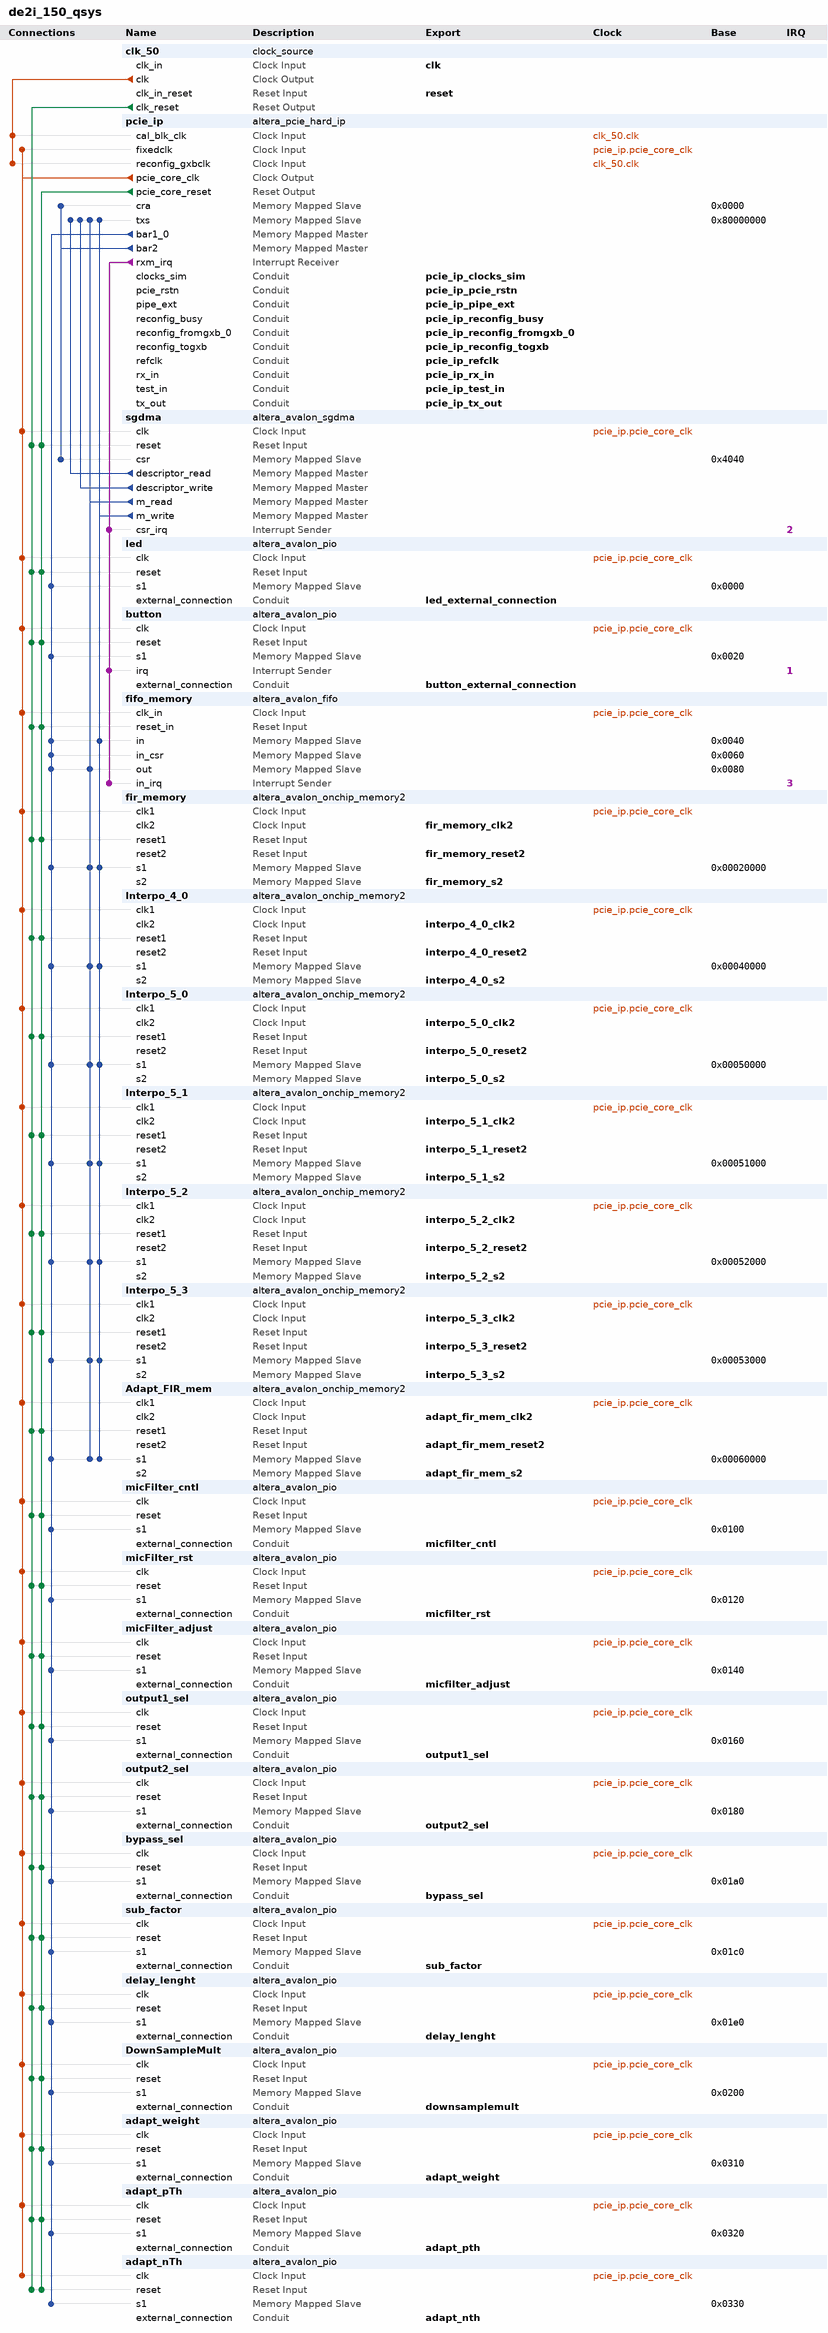
[diagram p0: system contents]
# Platform Designer (Qsys) system de2i_150_qsys, Cyclone IV GX EP4CGX150DF31C7
# Parameters at their usual value, and those the tool derives, are not listed.
package require -exact qsys 14.0
create_system de2i_150_qsys
set_project_property DEVICE_FAMILY {Cyclone IV GX}
set_project_property DEVICE EP4CGX150DF31C7

add_instance clk_50 clock_source 14.0
set_instance_parameter_value clk_50 clockFrequency 50000000

add_instance pcie_ip altera_pcie_hard_ip 14.0
set_instance_parameter_value pcie_ip p_pcie_test_out_width None
set_instance_parameter_value pcie_ip {BAR Type} {64 bit Prefetchable,Not used,32 bit Non-Prefetchable,Not used,Not used,Not used}
set_instance_parameter_value pcie_ip vendor_id 4466
set_instance_parameter_value pcie_ip device_id 57345
set_instance_parameter_value pcie_ip class_code 0
set_instance_parameter_value pcie_ip subsystem_vendor_id 4466
set_instance_parameter_value pcie_ip subsystem_device_id 4
set_instance_parameter_value pcie_ip my_advanced_errors false
set_instance_parameter_value pcie_ip my_enable_ecrc_check false
set_instance_parameter_value pcie_ip my_enable_ecrc_gen false
set_instance_parameter_value pcie_ip CG_NO_CPL_REORDERING 0
set_instance_parameter_value pcie_ip CG_ENABLE_A2P_INTERRUPT 0
set_instance_parameter_value pcie_ip p_user_msi_enable 0
set_instance_parameter_value pcie_ip CB_A2P_ADDR_MAP_PASS_THRU_BITS 31
set_instance_parameter_value pcie_ip {PCIe Address 63:32} 0x00000000,0x00000000,0x00000000,0x00000000,0x00000000,0x00000000,0x00000000,0x00000000,0x00000000,0x00000000,0x00000000,0x00000000,0x00000000,0x00000000,0x00000000,0x00000000
set_instance_parameter_value pcie_ip {PCIe Address 31:0} 0x00000000,0x00000000,0x00000000,0x00000000,0x00000000,0x00000000,0x00000000,0x00000000,0x00000000,0x00000000,0x00000000,0x00000000,0x00000000,0x00000000,0x00000000,0x00000000

add_instance sgdma altera_avalon_sgdma 14.0
set_instance_parameter_value sgdma enableBurstTransfers false
set_instance_parameter_value sgdma enableUnalignedTransfers false
set_instance_parameter_value sgdma readBlockDataWidth 64
set_instance_parameter_value sgdma sinkErrorWidth 0
set_instance_parameter_value sgdma sourceErrorWidth 0
set_instance_parameter_value sgdma transferMode MEMORY_TO_MEMORY
set_instance_parameter_value sgdma writeBurstcountWidth 4

add_instance led altera_avalon_pio 14.0
set_instance_parameter_value led direction Output
set_instance_parameter_value led width 4

add_instance button altera_avalon_pio 14.0
set_instance_parameter_value button captureEdge true
set_instance_parameter_value button direction Input
set_instance_parameter_value button edgeType FALLING
set_instance_parameter_value button generateIRQ true
set_instance_parameter_value button irqType EDGE
set_instance_parameter_value button width 4

add_instance fifo_memory altera_avalon_fifo 14.0
set_instance_parameter_value fifo_memory avalonMMAvalonMMDataWidth 64
set_instance_parameter_value fifo_memory bitsPerSymbol 16
set_instance_parameter_value fifo_memory channelWidth 8
set_instance_parameter_value fifo_memory errorWidth 8
set_instance_parameter_value fifo_memory fifoDepth 2048
set_instance_parameter_value fifo_memory fifoInputInterfaceOptions AVALONMM_WRITE
set_instance_parameter_value fifo_memory fifoOutputInterfaceOptions AVALONMM_READ
set_instance_parameter_value fifo_memory singleClockMode true
set_instance_parameter_value fifo_memory symbolsPerBeat 2
set_instance_parameter_value fifo_memory useIRQ true
set_instance_parameter_value fifo_memory usePacket true
set_instance_parameter_value fifo_memory useReadControl false

add_instance fir_memory altera_avalon_onchip_memory2 14.0
set_instance_parameter_value fir_memory dataWidth 32
set_instance_parameter_value fir_memory dualPort true
set_instance_parameter_value fir_memory initMemContent true
set_instance_parameter_value fir_memory initializationFileName onchip_memory
set_instance_parameter_value fir_memory memorySize 4096

add_instance Interpo_4_0 altera_avalon_onchip_memory2 14.0
set_instance_parameter_value Interpo_4_0 dataWidth 32
set_instance_parameter_value Interpo_4_0 dualPort true
set_instance_parameter_value Interpo_4_0 initMemContent true
set_instance_parameter_value Interpo_4_0 initializationFileName onchip_memory
set_instance_parameter_value Interpo_4_0 memorySize 128

add_instance Interpo_5_0 altera_avalon_onchip_memory2 14.0
set_instance_parameter_value Interpo_5_0 dataWidth 32
set_instance_parameter_value Interpo_5_0 dualPort true
set_instance_parameter_value Interpo_5_0 initMemContent true
set_instance_parameter_value Interpo_5_0 initializationFileName onchip_memory
set_instance_parameter_value Interpo_5_0 memorySize 160

add_instance Interpo_5_1 altera_avalon_onchip_memory2 14.0
set_instance_parameter_value Interpo_5_1 dataWidth 32
set_instance_parameter_value Interpo_5_1 dualPort true
set_instance_parameter_value Interpo_5_1 initMemContent true
set_instance_parameter_value Interpo_5_1 initializationFileName onchip_memory
set_instance_parameter_value Interpo_5_1 memorySize 160

add_instance Interpo_5_2 altera_avalon_onchip_memory2 14.0
set_instance_parameter_value Interpo_5_2 dataWidth 32
set_instance_parameter_value Interpo_5_2 dualPort true
set_instance_parameter_value Interpo_5_2 initMemContent true
set_instance_parameter_value Interpo_5_2 initializationFileName onchip_memory
set_instance_parameter_value Interpo_5_2 memorySize 160

add_instance Interpo_5_3 altera_avalon_onchip_memory2 14.0
set_instance_parameter_value Interpo_5_3 dataWidth 32
set_instance_parameter_value Interpo_5_3 dualPort true
set_instance_parameter_value Interpo_5_3 initMemContent true
set_instance_parameter_value Interpo_5_3 initializationFileName onchip_memory
set_instance_parameter_value Interpo_5_3 memorySize 160

add_instance Adapt_FIR_mem altera_avalon_onchip_memory2 14.0
set_instance_parameter_value Adapt_FIR_mem dataWidth 32
set_instance_parameter_value Adapt_FIR_mem dualPort true
set_instance_parameter_value Adapt_FIR_mem initMemContent true
set_instance_parameter_value Adapt_FIR_mem initializationFileName onchip_memory
set_instance_parameter_value Adapt_FIR_mem memorySize 2048

add_instance micFilter_cntl altera_avalon_pio 14.0
set_instance_parameter_value micFilter_cntl bitModifyingOutReg true
set_instance_parameter_value micFilter_cntl direction Output
set_instance_parameter_value micFilter_cntl width 32

add_instance micFilter_rst altera_avalon_pio 14.0
set_instance_parameter_value micFilter_rst direction Output
set_instance_parameter_value micFilter_rst width 1

add_instance micFilter_adjust altera_avalon_pio 14.0
set_instance_parameter_value micFilter_adjust direction Output
set_instance_parameter_value micFilter_adjust width 1

add_instance output1_sel altera_avalon_pio 14.0
set_instance_parameter_value output1_sel direction Output
set_instance_parameter_value output1_sel width 4

add_instance output2_sel altera_avalon_pio 14.0
set_instance_parameter_value output2_sel direction Output
set_instance_parameter_value output2_sel width 4

add_instance bypass_sel altera_avalon_pio 14.0
set_instance_parameter_value bypass_sel direction Output
set_instance_parameter_value bypass_sel width 3

add_instance sub_factor altera_avalon_pio 14.0
set_instance_parameter_value sub_factor direction Output
set_instance_parameter_value sub_factor width 16

add_instance delay_lenght altera_avalon_pio 14.0
set_instance_parameter_value delay_lenght direction Output
set_instance_parameter_value delay_lenght width 19

add_instance DownSampleMult altera_avalon_pio 14.0
set_instance_parameter_value DownSampleMult direction Output
set_instance_parameter_value DownSampleMult width 32

add_instance adapt_weight altera_avalon_pio 14.0
set_instance_parameter_value adapt_weight direction Output
set_instance_parameter_value adapt_weight width 32

add_instance adapt_pTh altera_avalon_pio 14.0
set_instance_parameter_value adapt_pTh direction Output
set_instance_parameter_value adapt_pTh width 16

add_instance adapt_nTh altera_avalon_pio 14.0
set_instance_parameter_value adapt_nTh direction Output
set_instance_parameter_value adapt_nTh width 16

# connections
add_connection clk_50.clk pcie_ip.cal_blk_clk clock
add_connection clk_50.clk pcie_ip.reconfig_gxbclk clock
add_connection pcie_ip.pcie_core_clk Adapt_FIR_mem.clk1 clock
add_connection pcie_ip.pcie_core_clk adapt_nTh.clk clock
add_connection pcie_ip.pcie_core_clk adapt_pTh.clk clock
add_connection pcie_ip.pcie_core_clk adapt_weight.clk clock
add_connection pcie_ip.pcie_core_clk button.clk clock
add_connection pcie_ip.pcie_core_clk bypass_sel.clk clock
add_connection pcie_ip.pcie_core_clk delay_lenght.clk clock
add_connection pcie_ip.pcie_core_clk DownSampleMult.clk clock
add_connection pcie_ip.pcie_core_clk fifo_memory.clk_in clock
add_connection pcie_ip.pcie_core_clk fir_memory.clk1 clock
add_connection pcie_ip.pcie_core_clk Interpo_4_0.clk1 clock
add_connection pcie_ip.pcie_core_clk Interpo_5_0.clk1 clock
add_connection pcie_ip.pcie_core_clk Interpo_5_1.clk1 clock
add_connection pcie_ip.pcie_core_clk Interpo_5_2.clk1 clock
add_connection pcie_ip.pcie_core_clk Interpo_5_3.clk1 clock
add_connection pcie_ip.pcie_core_clk led.clk clock
add_connection pcie_ip.pcie_core_clk micFilter_adjust.clk clock
add_connection pcie_ip.pcie_core_clk micFilter_cntl.clk clock
add_connection pcie_ip.pcie_core_clk micFilter_rst.clk clock
add_connection pcie_ip.pcie_core_clk output1_sel.clk clock
add_connection pcie_ip.pcie_core_clk output2_sel.clk clock
add_connection pcie_ip.pcie_core_clk pcie_ip.fixedclk clock
add_connection pcie_ip.pcie_core_clk sgdma.clk clock
add_connection pcie_ip.pcie_core_clk sub_factor.clk clock
add_connection clk_50.clk_reset Adapt_FIR_mem.reset1 reset
add_connection clk_50.clk_reset adapt_nTh.reset reset
add_connection clk_50.clk_reset adapt_pTh.reset reset
add_connection clk_50.clk_reset adapt_weight.reset reset
add_connection clk_50.clk_reset button.reset reset
add_connection clk_50.clk_reset bypass_sel.reset reset
add_connection clk_50.clk_reset delay_lenght.reset reset
add_connection clk_50.clk_reset DownSampleMult.reset reset
add_connection clk_50.clk_reset fifo_memory.reset_in reset
add_connection clk_50.clk_reset fir_memory.reset1 reset
add_connection clk_50.clk_reset Interpo_4_0.reset1 reset
add_connection clk_50.clk_reset Interpo_5_0.reset1 reset
add_connection clk_50.clk_reset Interpo_5_1.reset1 reset
add_connection clk_50.clk_reset Interpo_5_2.reset1 reset
add_connection clk_50.clk_reset Interpo_5_3.reset1 reset
add_connection clk_50.clk_reset led.reset reset
add_connection clk_50.clk_reset micFilter_adjust.reset reset
add_connection clk_50.clk_reset micFilter_cntl.reset reset
add_connection clk_50.clk_reset micFilter_rst.reset reset
add_connection clk_50.clk_reset output1_sel.reset reset
add_connection clk_50.clk_reset output2_sel.reset reset
add_connection clk_50.clk_reset sgdma.reset reset
add_connection clk_50.clk_reset sub_factor.reset reset
add_connection pcie_ip.pcie_core_reset Adapt_FIR_mem.reset1 reset
add_connection pcie_ip.pcie_core_reset adapt_nTh.reset reset
add_connection pcie_ip.pcie_core_reset adapt_pTh.reset reset
add_connection pcie_ip.pcie_core_reset adapt_weight.reset reset
add_connection pcie_ip.pcie_core_reset button.reset reset
add_connection pcie_ip.pcie_core_reset bypass_sel.reset reset
add_connection pcie_ip.pcie_core_reset delay_lenght.reset reset
add_connection pcie_ip.pcie_core_reset DownSampleMult.reset reset
add_connection pcie_ip.pcie_core_reset fifo_memory.reset_in reset
add_connection pcie_ip.pcie_core_reset fir_memory.reset1 reset
add_connection pcie_ip.pcie_core_reset Interpo_4_0.reset1 reset
add_connection pcie_ip.pcie_core_reset Interpo_5_0.reset1 reset
add_connection pcie_ip.pcie_core_reset Interpo_5_1.reset1 reset
add_connection pcie_ip.pcie_core_reset Interpo_5_2.reset1 reset
add_connection pcie_ip.pcie_core_reset Interpo_5_3.reset1 reset
add_connection pcie_ip.pcie_core_reset led.reset reset
add_connection pcie_ip.pcie_core_reset micFilter_adjust.reset reset
add_connection pcie_ip.pcie_core_reset micFilter_cntl.reset reset
add_connection pcie_ip.pcie_core_reset micFilter_rst.reset reset
add_connection pcie_ip.pcie_core_reset output1_sel.reset reset
add_connection pcie_ip.pcie_core_reset output2_sel.reset reset
add_connection pcie_ip.pcie_core_reset sgdma.reset reset
add_connection pcie_ip.pcie_core_reset sub_factor.reset reset
add_connection pcie_ip.bar1_0 Adapt_FIR_mem.s1 avalon
set_connection_parameter_value pcie_ip.bar1_0/Adapt_FIR_mem.s1 baseAddress 0x00060000
add_connection pcie_ip.bar1_0 adapt_nTh.s1 avalon
set_connection_parameter_value pcie_ip.bar1_0/adapt_nTh.s1 baseAddress 0x0330
add_connection pcie_ip.bar1_0 adapt_pTh.s1 avalon
set_connection_parameter_value pcie_ip.bar1_0/adapt_pTh.s1 baseAddress 0x0320
add_connection pcie_ip.bar1_0 adapt_weight.s1 avalon
set_connection_parameter_value pcie_ip.bar1_0/adapt_weight.s1 baseAddress 0x0310
add_connection pcie_ip.bar1_0 button.s1 avalon
set_connection_parameter_value pcie_ip.bar1_0/button.s1 baseAddress 0x0020
add_connection pcie_ip.bar1_0 bypass_sel.s1 avalon
set_connection_parameter_value pcie_ip.bar1_0/bypass_sel.s1 baseAddress 0x01a0
add_connection pcie_ip.bar1_0 delay_lenght.s1 avalon
set_connection_parameter_value pcie_ip.bar1_0/delay_lenght.s1 baseAddress 0x01e0
add_connection pcie_ip.bar1_0 DownSampleMult.s1 avalon
set_connection_parameter_value pcie_ip.bar1_0/DownSampleMult.s1 baseAddress 0x0200
add_connection pcie_ip.bar1_0 fifo_memory.in avalon
set_connection_parameter_value pcie_ip.bar1_0/fifo_memory.in baseAddress 0x0040
add_connection pcie_ip.bar1_0 fifo_memory.in_csr avalon
set_connection_parameter_value pcie_ip.bar1_0/fifo_memory.in_csr baseAddress 0x0060
add_connection pcie_ip.bar1_0 fifo_memory.out avalon
set_connection_parameter_value pcie_ip.bar1_0/fifo_memory.out baseAddress 0x0080
add_connection pcie_ip.bar1_0 fir_memory.s1 avalon
set_connection_parameter_value pcie_ip.bar1_0/fir_memory.s1 baseAddress 0x00020000
add_connection pcie_ip.bar1_0 Interpo_4_0.s1 avalon
set_connection_parameter_value pcie_ip.bar1_0/Interpo_4_0.s1 baseAddress 0x00040000
add_connection pcie_ip.bar1_0 Interpo_5_0.s1 avalon
set_connection_parameter_value pcie_ip.bar1_0/Interpo_5_0.s1 baseAddress 0x00050000
add_connection pcie_ip.bar1_0 Interpo_5_1.s1 avalon
set_connection_parameter_value pcie_ip.bar1_0/Interpo_5_1.s1 baseAddress 0x00051000
add_connection pcie_ip.bar1_0 Interpo_5_2.s1 avalon
set_connection_parameter_value pcie_ip.bar1_0/Interpo_5_2.s1 baseAddress 0x00052000
add_connection pcie_ip.bar1_0 Interpo_5_3.s1 avalon
set_connection_parameter_value pcie_ip.bar1_0/Interpo_5_3.s1 baseAddress 0x00053000
add_connection pcie_ip.bar1_0 led.s1 avalon
set_connection_parameter_value pcie_ip.bar1_0/led.s1 baseAddress 0x0000
add_connection pcie_ip.bar1_0 micFilter_adjust.s1 avalon
set_connection_parameter_value pcie_ip.bar1_0/micFilter_adjust.s1 baseAddress 0x0140
add_connection pcie_ip.bar1_0 micFilter_cntl.s1 avalon
set_connection_parameter_value pcie_ip.bar1_0/micFilter_cntl.s1 baseAddress 0x0100
add_connection pcie_ip.bar1_0 micFilter_rst.s1 avalon
set_connection_parameter_value pcie_ip.bar1_0/micFilter_rst.s1 baseAddress 0x0120
add_connection pcie_ip.bar1_0 output1_sel.s1 avalon
set_connection_parameter_value pcie_ip.bar1_0/output1_sel.s1 baseAddress 0x0160
add_connection pcie_ip.bar1_0 output2_sel.s1 avalon
set_connection_parameter_value pcie_ip.bar1_0/output2_sel.s1 baseAddress 0x0180
add_connection pcie_ip.bar1_0 sub_factor.s1 avalon
set_connection_parameter_value pcie_ip.bar1_0/sub_factor.s1 baseAddress 0x01c0
add_connection pcie_ip.bar2 pcie_ip.cra avalon
set_connection_parameter_value pcie_ip.bar2/pcie_ip.cra baseAddress 0x0000
add_connection pcie_ip.bar2 sgdma.csr avalon
set_connection_parameter_value pcie_ip.bar2/sgdma.csr baseAddress 0x4040
add_connection sgdma.descriptor_read pcie_ip.txs avalon
set_connection_parameter_value sgdma.descriptor_read/pcie_ip.txs baseAddress 0x80000000
add_connection sgdma.descriptor_write pcie_ip.txs avalon
set_connection_parameter_value sgdma.descriptor_write/pcie_ip.txs baseAddress 0x80000000
add_connection sgdma.m_read Adapt_FIR_mem.s1 avalon
set_connection_parameter_value sgdma.m_read/Adapt_FIR_mem.s1 baseAddress 0x00060000
add_connection sgdma.m_read fifo_memory.out avalon
set_connection_parameter_value sgdma.m_read/fifo_memory.out baseAddress 0x0080
add_connection sgdma.m_read fir_memory.s1 avalon
set_connection_parameter_value sgdma.m_read/fir_memory.s1 baseAddress 0x00020000
add_connection sgdma.m_read Interpo_4_0.s1 avalon
set_connection_parameter_value sgdma.m_read/Interpo_4_0.s1 baseAddress 0x00040000
add_connection sgdma.m_read Interpo_5_0.s1 avalon
set_connection_parameter_value sgdma.m_read/Interpo_5_0.s1 baseAddress 0x00050000
add_connection sgdma.m_read Interpo_5_1.s1 avalon
set_connection_parameter_value sgdma.m_read/Interpo_5_1.s1 baseAddress 0x00051000
add_connection sgdma.m_read Interpo_5_2.s1 avalon
set_connection_parameter_value sgdma.m_read/Interpo_5_2.s1 baseAddress 0x00052000
add_connection sgdma.m_read Interpo_5_3.s1 avalon
set_connection_parameter_value sgdma.m_read/Interpo_5_3.s1 baseAddress 0x00053000
add_connection sgdma.m_read pcie_ip.txs avalon
set_connection_parameter_value sgdma.m_read/pcie_ip.txs baseAddress 0x80000000
add_connection sgdma.m_write Adapt_FIR_mem.s1 avalon
set_connection_parameter_value sgdma.m_write/Adapt_FIR_mem.s1 baseAddress 0x00060000
add_connection sgdma.m_write fifo_memory.in avalon
set_connection_parameter_value sgdma.m_write/fifo_memory.in baseAddress 0x0040
add_connection sgdma.m_write fir_memory.s1 avalon
set_connection_parameter_value sgdma.m_write/fir_memory.s1 baseAddress 0x00020000
add_connection sgdma.m_write Interpo_4_0.s1 avalon
set_connection_parameter_value sgdma.m_write/Interpo_4_0.s1 baseAddress 0x00040000
add_connection sgdma.m_write Interpo_5_0.s1 avalon
set_connection_parameter_value sgdma.m_write/Interpo_5_0.s1 baseAddress 0x00050000
add_connection sgdma.m_write Interpo_5_1.s1 avalon
set_connection_parameter_value sgdma.m_write/Interpo_5_1.s1 baseAddress 0x00051000
add_connection sgdma.m_write Interpo_5_2.s1 avalon
set_connection_parameter_value sgdma.m_write/Interpo_5_2.s1 baseAddress 0x00052000
add_connection sgdma.m_write Interpo_5_3.s1 avalon
set_connection_parameter_value sgdma.m_write/Interpo_5_3.s1 baseAddress 0x00053000
add_connection sgdma.m_write pcie_ip.txs avalon
set_connection_parameter_value sgdma.m_write/pcie_ip.txs baseAddress 0x80000000
add_connection pcie_ip.rxm_irq button.irq interrupt
set_connection_parameter_value pcie_ip.rxm_irq/button.irq irqNumber 1
add_connection pcie_ip.rxm_irq fifo_memory.in_irq interrupt
set_connection_parameter_value pcie_ip.rxm_irq/fifo_memory.in_irq irqNumber 3
add_connection pcie_ip.rxm_irq sgdma.csr_irq interrupt
set_connection_parameter_value pcie_ip.rxm_irq/sgdma.csr_irq irqNumber 2

# exported interfaces
add_interface clk clock sink
set_interface_property clk EXPORT_OF clk_50.clk_in
add_interface reset reset sink
set_interface_property reset EXPORT_OF clk_50.clk_in_reset
add_interface pcie_ip_reconfig_togxb conduit end
set_interface_property pcie_ip_reconfig_togxb EXPORT_OF pcie_ip.reconfig_togxb
add_interface pcie_ip_refclk conduit end
set_interface_property pcie_ip_refclk EXPORT_OF pcie_ip.refclk
add_interface pcie_ip_test_in conduit end
set_interface_property pcie_ip_test_in EXPORT_OF pcie_ip.test_in
add_interface pcie_ip_pcie_rstn conduit end
set_interface_property pcie_ip_pcie_rstn EXPORT_OF pcie_ip.pcie_rstn
add_interface pcie_ip_clocks_sim conduit end
set_interface_property pcie_ip_clocks_sim EXPORT_OF pcie_ip.clocks_sim
add_interface pcie_ip_reconfig_busy conduit end
set_interface_property pcie_ip_reconfig_busy EXPORT_OF pcie_ip.reconfig_busy
add_interface pcie_ip_pipe_ext conduit end
set_interface_property pcie_ip_pipe_ext EXPORT_OF pcie_ip.pipe_ext
add_interface pcie_ip_rx_in conduit end
set_interface_property pcie_ip_rx_in EXPORT_OF pcie_ip.rx_in
add_interface pcie_ip_tx_out conduit end
set_interface_property pcie_ip_tx_out EXPORT_OF pcie_ip.tx_out
add_interface pcie_ip_reconfig_fromgxb_0 conduit end
set_interface_property pcie_ip_reconfig_fromgxb_0 EXPORT_OF pcie_ip.reconfig_fromgxb_0
add_interface led_external_connection conduit end
set_interface_property led_external_connection EXPORT_OF led.external_connection
add_interface button_external_connection conduit end
set_interface_property button_external_connection EXPORT_OF button.external_connection
add_interface fir_memory_s2 avalon slave
set_interface_property fir_memory_s2 EXPORT_OF fir_memory.s2
add_interface fir_memory_clk2 clock sink
set_interface_property fir_memory_clk2 EXPORT_OF fir_memory.clk2
add_interface fir_memory_reset2 reset sink
set_interface_property fir_memory_reset2 EXPORT_OF fir_memory.reset2
add_interface interpo_4_0_s2 avalon slave
set_interface_property interpo_4_0_s2 EXPORT_OF Interpo_4_0.s2
add_interface interpo_4_0_clk2 clock sink
set_interface_property interpo_4_0_clk2 EXPORT_OF Interpo_4_0.clk2
add_interface interpo_4_0_reset2 reset sink
set_interface_property interpo_4_0_reset2 EXPORT_OF Interpo_4_0.reset2
add_interface interpo_5_0_s2 avalon slave
set_interface_property interpo_5_0_s2 EXPORT_OF Interpo_5_0.s2
add_interface interpo_5_0_clk2 clock sink
set_interface_property interpo_5_0_clk2 EXPORT_OF Interpo_5_0.clk2
add_interface interpo_5_0_reset2 reset sink
set_interface_property interpo_5_0_reset2 EXPORT_OF Interpo_5_0.reset2
add_interface interpo_5_1_clk2 clock sink
set_interface_property interpo_5_1_clk2 EXPORT_OF Interpo_5_1.clk2
add_interface interpo_5_1_s2 avalon slave
set_interface_property interpo_5_1_s2 EXPORT_OF Interpo_5_1.s2
add_interface interpo_5_1_reset2 reset sink
set_interface_property interpo_5_1_reset2 EXPORT_OF Interpo_5_1.reset2
add_interface interpo_5_2_s2 avalon slave
set_interface_property interpo_5_2_s2 EXPORT_OF Interpo_5_2.s2
add_interface interpo_5_2_clk2 clock sink
set_interface_property interpo_5_2_clk2 EXPORT_OF Interpo_5_2.clk2
add_interface interpo_5_2_reset2 reset sink
set_interface_property interpo_5_2_reset2 EXPORT_OF Interpo_5_2.reset2
add_interface interpo_5_3_s2 avalon slave
set_interface_property interpo_5_3_s2 EXPORT_OF Interpo_5_3.s2
add_interface interpo_5_3_clk2 clock sink
set_interface_property interpo_5_3_clk2 EXPORT_OF Interpo_5_3.clk2
add_interface interpo_5_3_reset2 reset sink
set_interface_property interpo_5_3_reset2 EXPORT_OF Interpo_5_3.reset2
add_interface adapt_fir_mem_s2 avalon slave
set_interface_property adapt_fir_mem_s2 EXPORT_OF Adapt_FIR_mem.s2
add_interface adapt_fir_mem_clk2 clock sink
set_interface_property adapt_fir_mem_clk2 EXPORT_OF Adapt_FIR_mem.clk2
add_interface adapt_fir_mem_reset2 reset sink
set_interface_property adapt_fir_mem_reset2 EXPORT_OF Adapt_FIR_mem.reset2
add_interface micfilter_cntl conduit end
set_interface_property micfilter_cntl EXPORT_OF micFilter_cntl.external_connection
add_interface micfilter_rst conduit end
set_interface_property micfilter_rst EXPORT_OF micFilter_rst.external_connection
add_interface micfilter_adjust conduit end
set_interface_property micfilter_adjust EXPORT_OF micFilter_adjust.external_connection
add_interface output1_sel conduit end
set_interface_property output1_sel EXPORT_OF output1_sel.external_connection
add_interface output2_sel conduit end
set_interface_property output2_sel EXPORT_OF output2_sel.external_connection
add_interface bypass_sel conduit end
set_interface_property bypass_sel EXPORT_OF bypass_sel.external_connection
add_interface sub_factor conduit end
set_interface_property sub_factor EXPORT_OF sub_factor.external_connection
add_interface delay_lenght conduit end
set_interface_property delay_lenght EXPORT_OF delay_lenght.external_connection
add_interface downsamplemult conduit end
set_interface_property downsamplemult EXPORT_OF DownSampleMult.external_connection
add_interface adapt_weight conduit end
set_interface_property adapt_weight EXPORT_OF adapt_weight.external_connection
add_interface adapt_pth conduit end
set_interface_property adapt_pth EXPORT_OF adapt_pTh.external_connection
add_interface adapt_nth conduit end
set_interface_property adapt_nth EXPORT_OF adapt_nTh.external_connection

set_interconnect_requirement {$system} qsys_mm.clockCrossingAdapter HANDSHAKE
set_interconnect_requirement {$system} qsys_mm.maxAdditionalLatency 1

save_system de2i_150_qsys.qsys
